# EAGLE schematic mpu6050 (EAGLE 9.6.2)
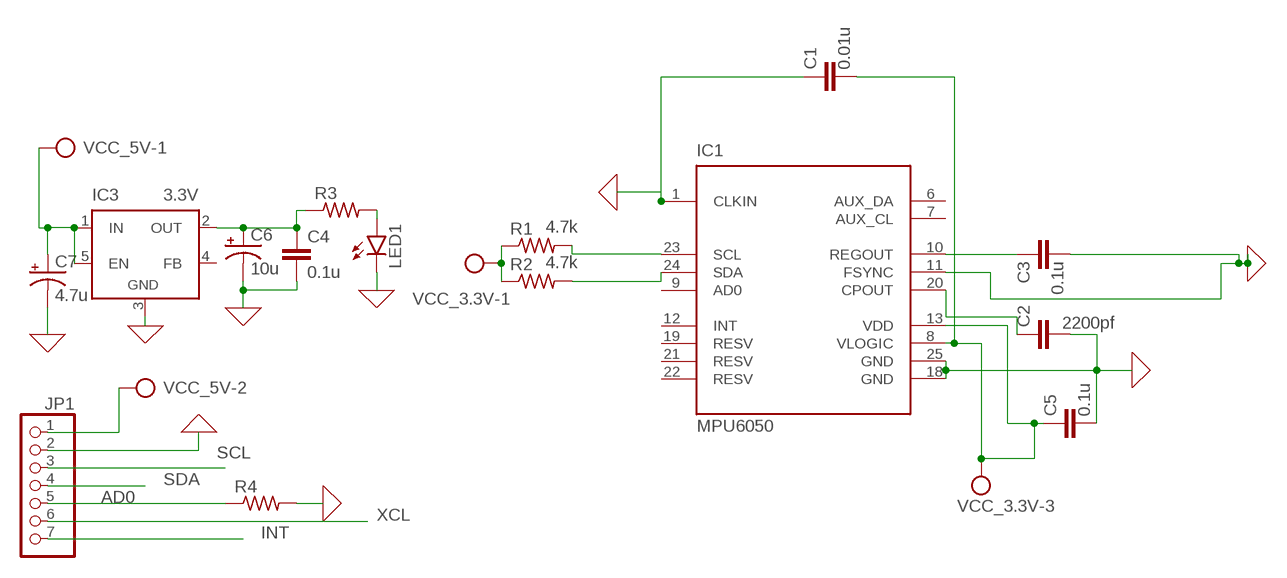
[diagram p0: schematic, sheet 1]

## Parts
C1  0.01u  C-EU025-024X044  [C025-024X044]
C2  2200pf  C-EU025-024X044  [C025-024X044]
C3  0.1u  C-EU025-024X044  [C025-024X044]
C4  0.1u  C-EUHPC0201  [HPC0201]
C5  0.1u  C-EU025-024X044  [C025-024X044]
C6  10u  CPOL-USE2.5-7  [E2,5-7]
C7  4.7u  CPOL-USE2.5-7  [E2,5-7]
IC1  MPU6050  [QFN50P400X400X95-25T265X275N]
IC3  3.3V  LM2596TH  [TO220-52]
JP1  PINHD-1X7/90  [1X07/90]
LED1  LED3MM  [LED3MM]
R1  4.7k  R-US_0207/5V  [0207/5V]
R2  4.7k  R-US_0207/5V  [0207/5V]
R3  R-US_0207/5V  [0207/5V]
R4  R-US_0207/5V  [0207/5V]
VCC_3.3V  AK300/3  [AK300/3]
VCC_5V  AK300/2  [AK300/2]

## Nets
0: C1.1 C2.2 C3.2 C4.2 C5.2 C6.- C7.- IC1.1(CLKIN) IC1.11(FSYNC) IC1.18(GND) IC1.25(GND) IC3.3(GND) JP1.2 LED1.K(C) R4.2 ; supply symbol labelled GND
AD0: JP1.5 R4.1
INT: JP1.7
N$3: C3.1 IC1.10(REGOUT)
N$4: C2.1 IC1.20(CPOUT)
N$5: IC1.23(SCL) R1.2
N$6: LED1.A R3.2
N$7: IC1.24(SDA) R2.2
N$12: C4.1 C6.+ IC3.2(OUT) R3.1
N$13: C7.+ IC3.1(IN) IC3.5(EN) VCC_5V.1
N$14: JP1.1 VCC_5V.2
N$15: R1.1 R2.1 VCC_3.3V.1
N$16: C1.2 C5.1 IC1.8(VLOGIC) IC1.13(VDD) VCC_3.3V.3
SCL: JP1.3
SDA: JP1.4
XCL: JP1.6
Unconnected: IC1.2(NC) IC1.3(NC) IC1.4(NC) IC1.5(NC) IC1.6(AUX_DA) IC1.7(AUX_CL) IC1.9(AD0) IC1.12(INT) IC1.14(NC) IC1.15(NC) IC1.16(NC) IC1.17(NC) IC1.19(RESV) IC1.21(RESV) IC1.22(RESV) IC3.4(FB) VCC_3.3V.2

## Library data of the parts
C1-C5 = rcl:C-EU: CAPACITOR, European symbol; SPICEPREFIX: C
C6 C7 = rcl:CPOL-US: POLARIZED CAPACITOR, American symbol; SPICEPREFIX: C
IC1 = invensense:MPU6050: The triple-axis MEMS gyroscope
IC3 = linear:LM2596T: STEP-DOWN VOLTAGE REGULATOR
JP1 = pinhead:PINHD-1X7: PIN HEADER
LED1 = led:LED: LED OSRAM: - CHIPLED LG R971, LG N971, LY N971, LG Q971, LY Q971, LO R971, LY R971 LH N974, LH R974 LS Q976, LO Q976, LY Q976 LO Q996 - Hyper CHIPLED LW Q18S LB Q993, LB Q99A, LB R99A - SideLED LS A670, LO A670, LY A670, LG A670, LP A670 LB A673, LV A673, LT A673, LW A673 LH A674 LY A675 LS A676, LA A676, LO A676, LY A676, LW A676 LS A679, LY A679, LG A679 - Hyper Micro SIDELED® LS Y876, LA Y876, LO Y876, LY Y876 LT Y87S - SmartLED LW L88C, LW L88S LB L89C, LB L89S, LG L890 LS L89K, LO L89K, LY L89K LS L896, LA L896, LO L896, LY L896 - TOPLED LS T670, LO T670, LY T670, LG T670, LP T670 LSG T670, LSP T670, LSY T670, LOP T670, LYG T670 LG T671, LOG T671, LSG T671 LB T673, LV T673, LT T673, LW T673 LH T674 LS T676, LA T676, LO T676, LY T676, LB T676, LH T676, LSB T676, LW T676 LB T67C, LV T67C, LT T67C, LS T67K, LO T67K, LY T67K, LW E67C LS E67B, LA E67B, LO E67B, LY E67B, LB E67C, LV E67C, LT E67C LW T67C LS T679, LY T679, LG T679 LS T770, LO T770, LY T770, LG T770, LP T770 LB T773, LV T773, LT T773, LW T773 LH T774 LS E675, LA E675, LY E675, LS T675 LS T776, LA T776, LO T776, LY T776, LB T776 LHGB T686 LT T68C, LB T68C - Hyper Mini TOPLED® LB M676 - Mini TOPLED Santana® LG M470 LS M47K, LO M47K, LY M47K Source: http://www.osram.convergy.de LUXEON: - LUMILED® LXK2-PW12-R00, LXK2-PW12-S00, LXK2-PW14-U00, LXK2-PW14-V00 LXK2-PM12-R00, LXK2-PM12-S00, LXK2-PM14-U00 LXK2-PE12-Q00, LXK2-PE12-R00, LXK2-PE12-S00, LXK2-PE14-T00, LXK2-PE14-U00 LXK2-PB12-K00, LXK2-PB12-L00, LXK2-PB12-M00, LXK2-PB14-N00, LXK2-PB14-P00, LXK2-PB14-Q00 LXK2-PR12-L00, LXK2-PR12-M00, LXK2-PR14-Q00, LXK2-PR14-R00 LXK2-PD12-Q00, LXK2-PD12-R00, LXK2-PD12-S00 LXK2-PH12-R00, LXK2-PH12-S00 LXK2-PL12-P00, LXK2-PL12-Q00, LXK2-PL12-R00 Source: www.luxeon.com KINGBRIGHT: KA-3528ASYC Source: www.kingbright.com
R1-R4 = rcl:R-US_: RESISTOR, American symbol; SPICEPREFIX: R
VCC_3.3V = con-ptr500:AK300/3: CONNECTOR; OC_FARNELL: unknown; OC_NEWARK: unknown
VCC_5V = con-ptr500:AK300/2: CONNECTOR; OC_FARNELL: unknown; OC_NEWARK: unknown